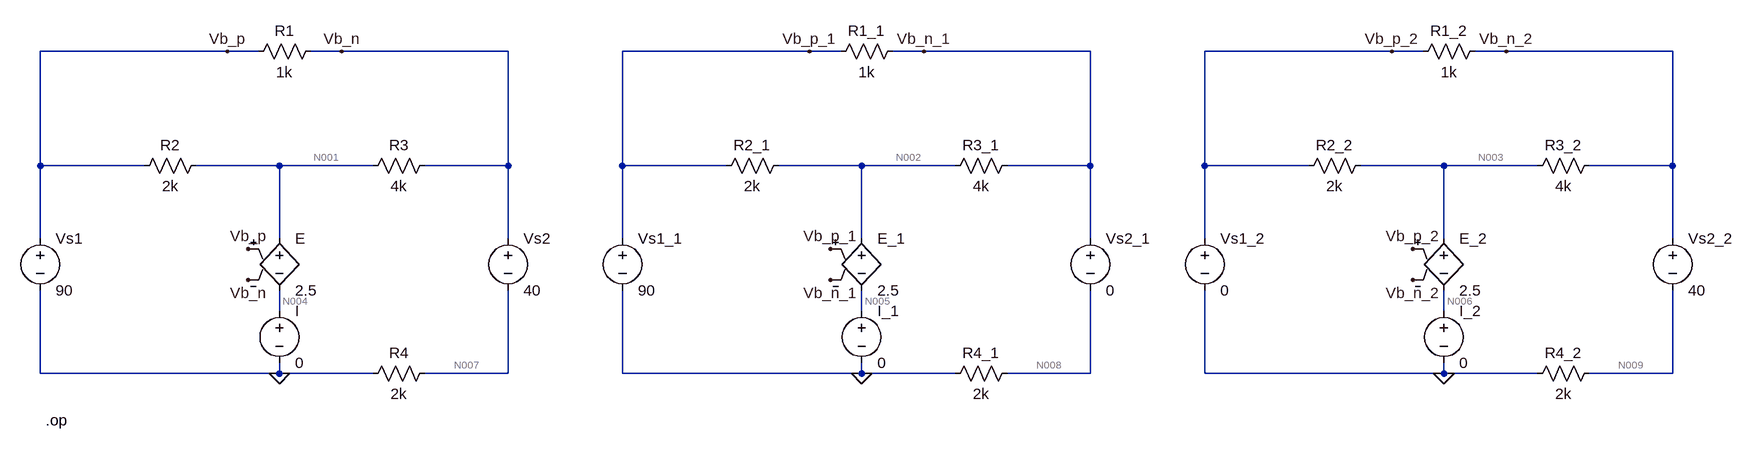
[diagram p0: schematic HW04P04.asc]
HW04P04.asc, the LTspice schematic file:
Version 4
SHEET 1 2676 680
WIRE 352 -176 64 -176
WIRE 400 -176 352 -176
WIRE 528 -176 480 -176
WIRE 784 -176 528 -176
WIRE 1248 -176 960 -176
WIRE 1296 -176 1248 -176
WIRE 1424 -176 1376 -176
WIRE 1680 -176 1424 -176
WIRE 2144 -176 1856 -176
WIRE 2192 -176 2144 -176
WIRE 2320 -176 2272 -176
WIRE 2576 -176 2320 -176
WIRE 64 0 64 -176
WIRE 224 0 64 0
WIRE 432 0 304 0
WIRE 576 0 432 0
WIRE 784 0 784 -176
WIRE 784 0 656 0
WIRE 960 0 960 -176
WIRE 1120 0 960 0
WIRE 1328 0 1200 0
WIRE 1472 0 1328 0
WIRE 1680 0 1680 -176
WIRE 1680 0 1552 0
WIRE 1856 0 1856 -176
WIRE 2016 0 1856 0
WIRE 2224 0 2096 0
WIRE 2368 0 2224 0
WIRE 2576 0 2576 -176
WIRE 2576 0 2448 0
WIRE 64 112 64 0
WIRE 432 112 432 0
WIRE 784 112 784 0
WIRE 960 112 960 0
WIRE 1328 112 1328 0
WIRE 1680 112 1680 0
WIRE 1856 112 1856 0
WIRE 2224 112 2224 0
WIRE 2576 112 2576 0
WIRE 432 224 432 192
WIRE 1328 224 1328 192
WIRE 2224 224 2224 192
WIRE 64 320 64 192
WIRE 432 320 432 304
WIRE 432 320 64 320
WIRE 576 320 432 320
WIRE 784 320 784 192
WIRE 784 320 656 320
WIRE 960 320 960 192
WIRE 1328 320 1328 304
WIRE 1328 320 960 320
WIRE 1472 320 1328 320
WIRE 1680 320 1680 192
WIRE 1680 320 1552 320
WIRE 1856 320 1856 192
WIRE 2224 320 2224 304
WIRE 2224 320 1856 320
WIRE 2368 320 2224 320
WIRE 2576 320 2576 192
WIRE 2576 320 2448 320
FLAG 432 320 0
FLAG 352 -176 Vb_p
FLAG 528 -176 Vb_n
FLAG 384 128 Vb_p
FLAG 384 176 Vb_n
FLAG 1328 320 0
FLAG 1248 -176 Vb_p_1
FLAG 1424 -176 Vb_n_1
FLAG 1280 128 Vb_p_1
FLAG 1280 176 Vb_n_1
FLAG 2224 320 0
FLAG 2144 -176 Vb_p_2
FLAG 2320 -176 Vb_n_2
FLAG 2176 128 Vb_p_2
FLAG 2176 176 Vb_n_2
SYMBOL voltage 64 96 R0
SYMATTR InstName Vs1
SYMATTR Value 90
SYMBOL res 320 -16 R90
WINDOW 0 0 56 VBottom 2
WINDOW 3 32 56 VTop 2
SYMATTR InstName R2
SYMATTR Value 2k
SYMBOL res 672 -16 R90
WINDOW 0 0 56 VBottom 2
WINDOW 3 32 56 VTop 2
SYMATTR InstName R3
SYMATTR Value 4k
SYMBOL res 672 304 R90
WINDOW 0 0 56 VBottom 2
WINDOW 3 32 56 VTop 2
SYMATTR InstName R4
SYMATTR Value 2k
SYMBOL res 496 -192 R90
WINDOW 0 0 56 VBottom 2
WINDOW 3 32 56 VTop 2
SYMATTR InstName R1
SYMATTR Value 1k
SYMBOL e 432 96 R0
SYMATTR InstName E
SYMATTR Value 2.5
SYMBOL voltage 784 96 R0
SYMATTR InstName Vs2
SYMATTR Value 40
SYMBOL voltage 960 96 R0
SYMATTR InstName Vs1_1
SYMATTR Value 90
SYMBOL res 1216 -16 R90
WINDOW 0 0 56 VBottom 2
WINDOW 3 32 56 VTop 2
SYMATTR InstName R2_1
SYMATTR Value 2k
SYMBOL res 1568 -16 R90
WINDOW 0 0 56 VBottom 2
WINDOW 3 32 56 VTop 2
SYMATTR InstName R3_1
SYMATTR Value 4k
SYMBOL res 1568 304 R90
WINDOW 0 0 56 VBottom 2
WINDOW 3 32 56 VTop 2
SYMATTR InstName R4_1
SYMATTR Value 2k
SYMBOL res 1392 -192 R90
WINDOW 0 0 56 VBottom 2
WINDOW 3 32 56 VTop 2
SYMATTR InstName R1_1
SYMATTR Value 1k
SYMBOL e 1328 96 R0
SYMATTR InstName E_1
SYMATTR Value 2.5
SYMBOL voltage 1680 96 R0
SYMATTR InstName Vs2_1
SYMATTR Value 0
SYMBOL voltage 1856 96 R0
SYMATTR InstName Vs1_2
SYMATTR Value 0
SYMBOL res 2112 -16 R90
WINDOW 0 0 56 VBottom 2
WINDOW 3 32 56 VTop 2
SYMATTR InstName R2_2
SYMATTR Value 2k
SYMBOL res 2464 -16 R90
WINDOW 0 0 56 VBottom 2
WINDOW 3 32 56 VTop 2
SYMATTR InstName R3_2
SYMATTR Value 4k
SYMBOL res 2464 304 R90
WINDOW 0 0 56 VBottom 2
WINDOW 3 32 56 VTop 2
SYMATTR InstName R4_2
SYMATTR Value 2k
SYMBOL res 2288 -192 R90
WINDOW 0 0 56 VBottom 2
WINDOW 3 32 56 VTop 2
SYMATTR InstName R1_2
SYMATTR Value 1k
SYMBOL e 2224 96 R0
SYMATTR InstName E_2
SYMATTR Value 2.5
SYMBOL voltage 2576 96 R0
SYMATTR InstName Vs2_2
SYMATTR Value 40
SYMBOL voltage 432 208 R0
SYMATTR InstName I
SYMATTR Value 0
SYMBOL voltage 1328 208 R0
SYMATTR InstName I_1
SYMATTR Value 0
SYMBOL voltage 2224 208 R0
SYMATTR InstName I_2
SYMATTR Value 0
TEXT 72 392 Left 2 !.op

The netlist it stands for:
* HW04P04.asc
Vs1 Vb_p 0 90
R2 N001 Vb_p 2k
R3 Vb_n N001 4k
R4 N007 0 2k
R1 Vb_n Vb_p 1k
E N001 N004 Vb_p Vb_n 2.5
Vs2 Vb_n N007 40
Vs1_1 Vb_p_1 0 90
R2_1 N002 Vb_p_1 2k
R3_1 Vb_n_1 N002 4k
R4_1 N008 0 2k
R1_1 Vb_n_1 Vb_p_1 1k
E_1 N002 N005 Vb_p_1 Vb_n_1 2.5
Vs2_1 Vb_n_1 N008 0
Vs1_2 Vb_p_2 0 0
R2_2 N003 Vb_p_2 2k
R3_2 Vb_n_2 N003 4k
R4_2 N009 0 2k
R1_2 Vb_n_2 Vb_p_2 1k
E_2 N003 N006 Vb_p_2 Vb_n_2 2.5
Vs2_2 Vb_n_2 N009 40
V§I N004 0 0
V§I_1 N005 0 0
V§I_2 N006 0 0
.op
.backanno
.end

* Results of the author's LTspice run, read from the files saved beside the schematic
* Operating Point:
*   V(vb_p) = 90 V
*   V(n001) = 50 V
*   V(vb_n) = 70 V
*   V(n007) = 30 V
*   V(n004) = 0 V
*   V(vb_p_1) = 90 V
*   V(n002) = 71.05 V
*   V(vb_n_1) = 61.58 V
*   V(n008) = 61.58 V
*   V(n005) = 0 V
*   V(vb_p_2) = 0 V
*   V(n003) = -21.05 V
*   V(vb_n_2) = 8.421 V
*   V(n009) = -31.58 V
*   V(n006) = 0 V
*   I(R2) = -20 mA
*   I(R3) = 5 mA
*   I(R4) = 15 mA
*   I(R1) = -20 mA
*   I(R2_1) = -9.474 mA
*   I(R3_1) = -2.368 mA
*   I(R4_1) = 30.79 mA
*   I(R1_1) = -28.42 mA
*   I(R2_2) = -10.53 mA
*   I(R3_2) = 7.368 mA
*   I(R4_2) = -15.79 mA
*   I(R1_2) = 8.421 mA
*   I(E) = 25 mA
*   I(E_1) = 7.105 mA
*   I(E_2) = 17.89 mA
*   I(Vs1) = -40 mA
*   I(Vs2) = 15 mA
*   I(Vs1_1) = -37.89 mA
*   I(Vs2_1) = 30.79 mA
*   I(Vs1_2) = -2.105 mA
*   I(Vs2_2) = -15.79 mA
*   I(I) = 25 mA
*   I(I_1) = 7.105 mA
*   I(I_2) = 17.89 mA